# Altium schematic sheet SolarPanel3.SchDoc
size C
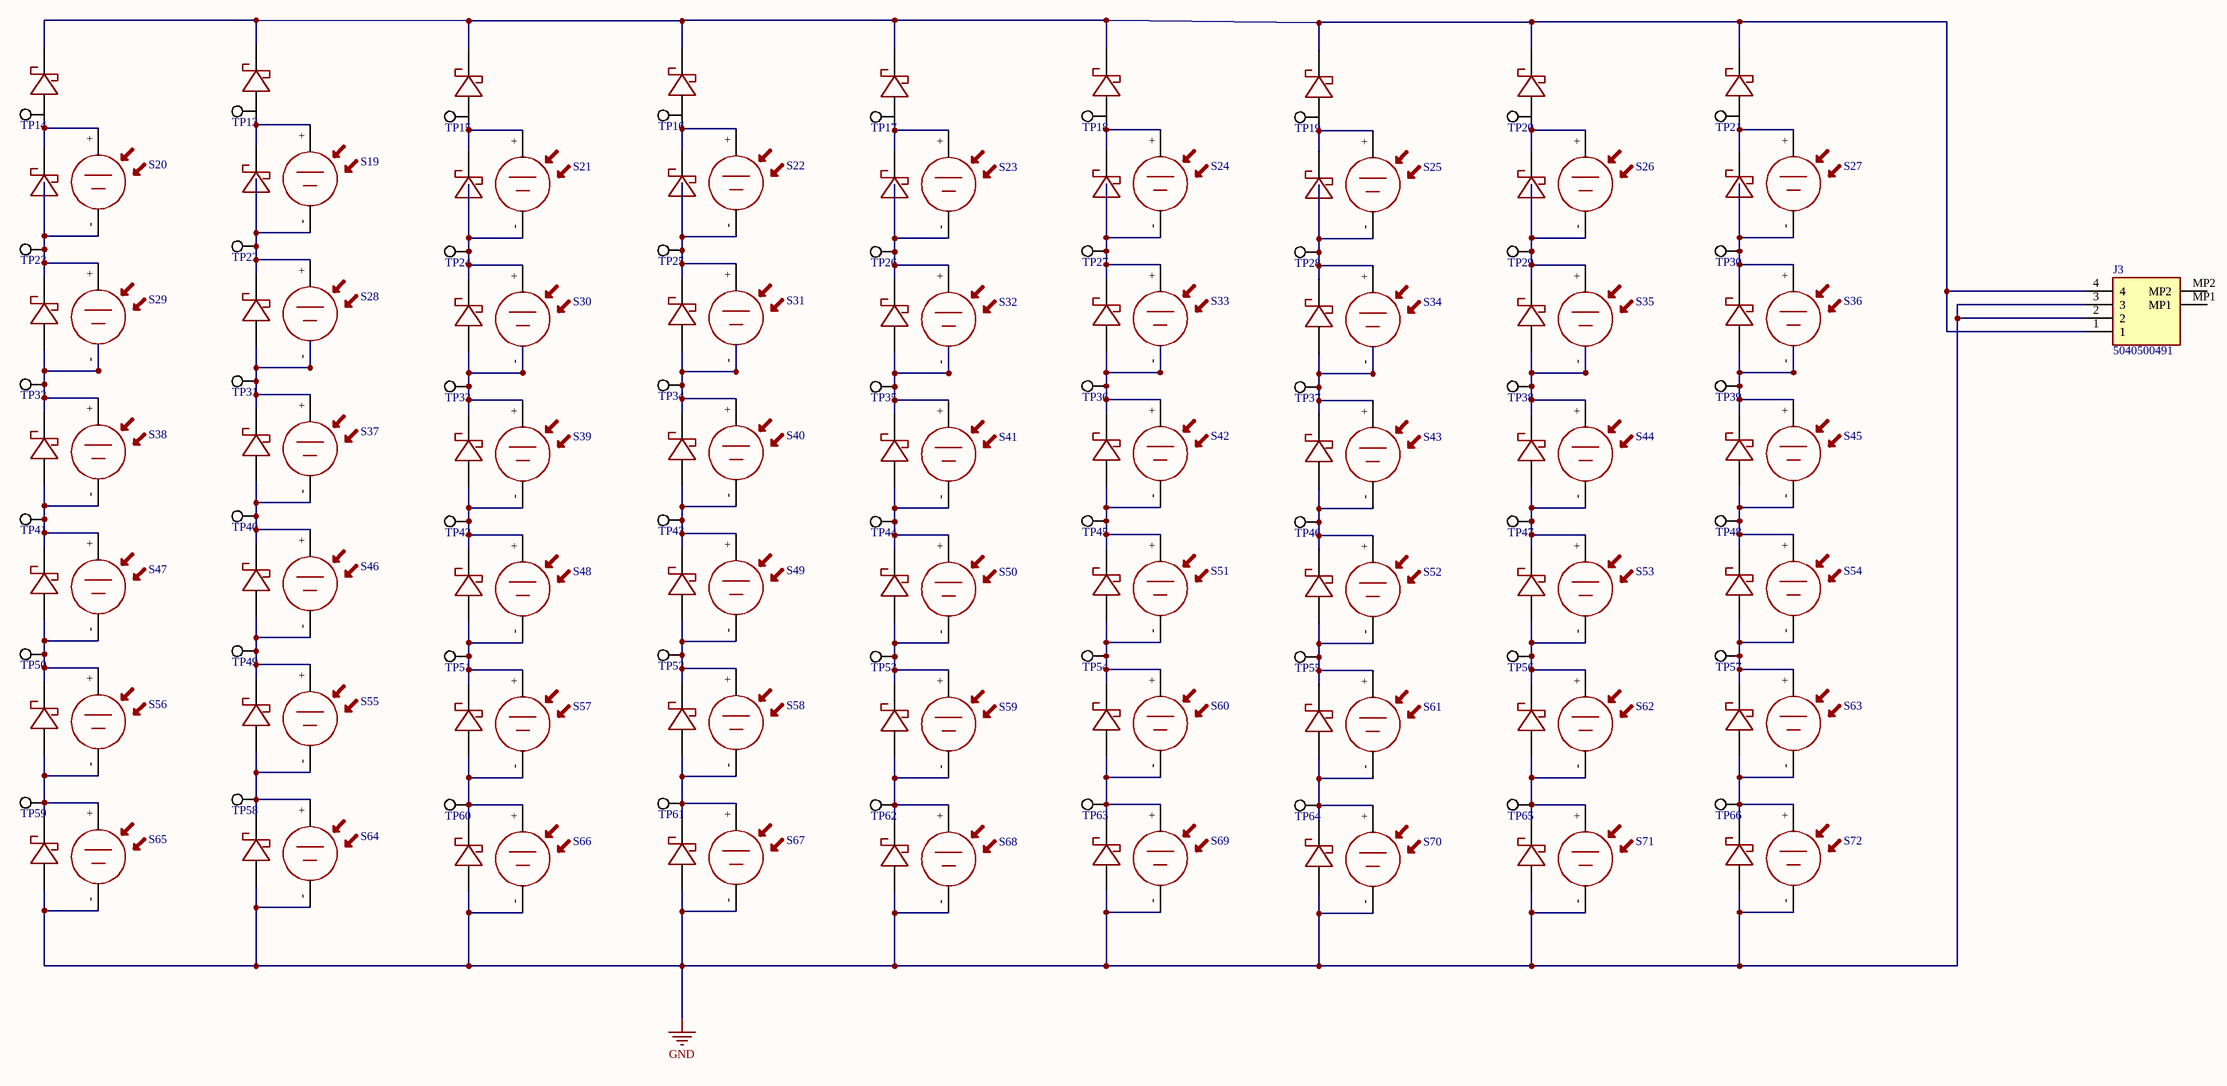
[diagram p0: SolarPanel3.SchDoc]

## Parts
D15  SCHOTTKY_DIODE_B120-FDICT-NDSCHOTTKY_DIODE_B120-FDICT-ND  [SB_DIODE]  (value not drawn)
D16  SCHOTTKY_DIODE_B120-FDICT-NDSCHOTTKY_DIODE_B120-FDICT-ND  [SB_DIODE]  (value not drawn)
D17  SCHOTTKY_DIODE_B120-FDICT-NDSCHOTTKY_DIODE_B120-FDICT-ND  [SB_DIODE]  (value not drawn)
D18  SCHOTTKY_DIODE_B120-FDICT-NDSCHOTTKY_DIODE_B120-FDICT-ND  [SB_DIODE]  (value not drawn)
D19  SCHOTTKY_DIODE_B120-FDICT-NDSCHOTTKY_DIODE_B120-FDICT-ND  [SB_DIODE]  (value not drawn)
D20  SCHOTTKY_DIODE_B120-FDICT-NDSCHOTTKY_DIODE_B120-FDICT-ND  [SB_DIODE]  (value not drawn)
D21  SCHOTTKY_DIODE_B120-FDICT-NDSCHOTTKY_DIODE_B120-FDICT-ND  [SB_DIODE]  (value not drawn)
D22  SCHOTTKY_DIODE_B120-FDICT-NDSCHOTTKY_DIODE_B120-FDICT-ND  [SB_DIODE]  (value not drawn)
D23  SCHOTTKY_DIODE_B120-FDICT-NDSCHOTTKY_DIODE_B120-FDICT-ND  [SB_DIODE]  (value not drawn)
D24  SCHOTTKY_DIODE_B120-FDICT-NDSCHOTTKY_DIODE_B120-FDICT-ND  [SB_DIODE]  (value not drawn)
D25  SCHOTTKY_DIODE_B120-FDICT-NDSCHOTTKY_DIODE_B120-FDICT-ND  [SB_DIODE]  (value not drawn)
D26  SCHOTTKY_DIODE_B120-FDICT-NDSCHOTTKY_DIODE_B120-FDICT-ND  [SB_DIODE]  (value not drawn)
D27  SCHOTTKY_DIODE_B120-FDICT-NDSCHOTTKY_DIODE_B120-FDICT-ND  [SB_DIODE]  (value not drawn)
D28  SCHOTTKY_DIODE_B120-FDICT-NDSCHOTTKY_DIODE_B120-FDICT-ND  [SB_DIODE]  (value not drawn)
D29  SCHOTTKY_DIODE_B120-FDICT-NDSCHOTTKY_DIODE_B120-FDICT-ND  [SB_DIODE]  (value not drawn)
D30  SCHOTTKY_DIODE_B120-FDICT-NDSCHOTTKY_DIODE_B120-FDICT-ND  [SB_DIODE]  (value not drawn)
D31  SCHOTTKY_DIODE_B120-FDICT-NDSCHOTTKY_DIODE_B120-FDICT-ND  [SB_DIODE]  (value not drawn)
D32  SCHOTTKY_DIODE_B120-FDICT-NDSCHOTTKY_DIODE_B120-FDICT-ND  [SB_DIODE]  (value not drawn)
D33  SCHOTTKY_DIODE_B120-FDICT-NDSCHOTTKY_DIODE_B120-FDICT-ND  [SB_DIODE]  (value not drawn)
D34  SCHOTTKY_DIODE_B120-FDICT-NDSCHOTTKY_DIODE_B120-FDICT-ND  [SB_DIODE]  (value not drawn)
D35  SCHOTTKY_DIODE_B120-FDICT-NDSCHOTTKY_DIODE_B120-FDICT-ND  [SB_DIODE]  (value not drawn)
D36  SCHOTTKY_DIODE_B120-FDICT-NDSCHOTTKY_DIODE_B120-FDICT-ND  [SB_DIODE]  (value not drawn)
D37  SCHOTTKY_DIODE_B120-FDICT-NDSCHOTTKY_DIODE_B120-FDICT-ND  [SB_DIODE]  (value not drawn)
D38  SCHOTTKY_DIODE_B120-FDICT-NDSCHOTTKY_DIODE_B120-FDICT-ND  [SB_DIODE]  (value not drawn)
D39  SCHOTTKY_DIODE_B120-FDICT-NDSCHOTTKY_DIODE_B120-FDICT-ND  [SB_DIODE]  (value not drawn)
D40  SCHOTTKY_DIODE_B120-FDICT-NDSCHOTTKY_DIODE_B120-FDICT-ND  [SB_DIODE]  (value not drawn)
D41  SCHOTTKY_DIODE_B120-FDICT-NDSCHOTTKY_DIODE_B120-FDICT-ND  [SB_DIODE]  (value not drawn)
D42  SCHOTTKY_DIODE_B120-FDICT-NDSCHOTTKY_DIODE_B120-FDICT-ND  [SB_DIODE]  (value not drawn)
D43  SCHOTTKY_DIODE_B120-FDICT-NDSCHOTTKY_DIODE_B120-FDICT-ND  [SB_DIODE]  (value not drawn)
D44  SCHOTTKY_DIODE_B120-FDICT-NDSCHOTTKY_DIODE_B120-FDICT-ND  [SB_DIODE]  (value not drawn)
D45  SCHOTTKY_DIODE_B120-FDICT-NDSCHOTTKY_DIODE_B120-FDICT-ND  [SB_DIODE]  (value not drawn)
D46  SCHOTTKY_DIODE_B120-FDICT-NDSCHOTTKY_DIODE_B120-FDICT-ND  [SB_DIODE]  (value not drawn)
D47  SCHOTTKY_DIODE_B120-FDICT-NDSCHOTTKY_DIODE_B120-FDICT-ND  [SB_DIODE]  (value not drawn)
D48  SCHOTTKY_DIODE_B120-FDICT-NDSCHOTTKY_DIODE_B120-FDICT-ND  [SB_DIODE]  (value not drawn)
D49  SCHOTTKY_DIODE_B120-FDICT-NDSCHOTTKY_DIODE_B120-FDICT-ND  [SB_DIODE]  (value not drawn)
D50  SCHOTTKY_DIODE_B120-FDICT-NDSCHOTTKY_DIODE_B120-FDICT-ND  [SB_DIODE]  (value not drawn)
D51  SCHOTTKY_DIODE_B120-FDICT-NDSCHOTTKY_DIODE_B120-FDICT-ND  [SB_DIODE]  (value not drawn)
D52  SCHOTTKY_DIODE_B120-FDICT-NDSCHOTTKY_DIODE_B120-FDICT-ND  [SB_DIODE]  (value not drawn)
D53  SCHOTTKY_DIODE_B120-FDICT-NDSCHOTTKY_DIODE_B120-FDICT-ND  [SB_DIODE]  (value not drawn)
D54  SCHOTTKY_DIODE_B120-FDICT-NDSCHOTTKY_DIODE_B120-FDICT-ND  [SB_DIODE]  (value not drawn)
D55  SCHOTTKY_DIODE_B120-FDICT-NDSCHOTTKY_DIODE_B120-FDICT-ND  [SB_DIODE]  (value not drawn)
D56  SCHOTTKY_DIODE_B120-FDICT-NDSCHOTTKY_DIODE_B120-FDICT-ND  [SB_DIODE]  (value not drawn)
D57  SCHOTTKY_DIODE_B120-FDICT-NDSCHOTTKY_DIODE_B120-FDICT-ND  [SB_DIODE]  (value not drawn)
D58  SCHOTTKY_DIODE_B120-FDICT-NDSCHOTTKY_DIODE_B120-FDICT-ND  [SB_DIODE]  (value not drawn)
D59  SCHOTTKY_DIODE_B120-FDICT-NDSCHOTTKY_DIODE_B120-FDICT-ND  [SB_DIODE]  (value not drawn)
D60  SCHOTTKY_DIODE_B120-FDICT-NDSCHOTTKY_DIODE_B120-FDICT-ND  [SB_DIODE]  (value not drawn)
D61  SCHOTTKY_DIODE_B120-FDICT-NDSCHOTTKY_DIODE_B120-FDICT-ND  [SB_DIODE]  (value not drawn)
D62  SCHOTTKY_DIODE_B120-FDICT-NDSCHOTTKY_DIODE_B120-FDICT-ND  [SB_DIODE]  (value not drawn)
D63  SCHOTTKY_DIODE_B120-FDICT-NDSCHOTTKY_DIODE_B120-FDICT-ND  [SB_DIODE]  (value not drawn)
D64  SCHOTTKY_DIODE_B120-FDICT-NDSCHOTTKY_DIODE_B120-FDICT-ND  [SB_DIODE]  (value not drawn)
D65  SCHOTTKY_DIODE_B120-FDICT-NDSCHOTTKY_DIODE_B120-FDICT-ND  [SB_DIODE]  (value not drawn)
D66  SCHOTTKY_DIODE_B120-FDICT-NDSCHOTTKY_DIODE_B120-FDICT-ND  [SB_DIODE]  (value not drawn)
D67  SCHOTTKY_DIODE_B120-FDICT-NDSCHOTTKY_DIODE_B120-FDICT-ND  [SB_DIODE]  (value not drawn)
D68  SCHOTTKY_DIODE_B120-FDICT-NDSCHOTTKY_DIODE_B120-FDICT-ND  [SB_DIODE]  (value not drawn)
D69  SCHOTTKY_DIODE_B120-FDICT-NDSCHOTTKY_DIODE_B120-FDICT-ND  [SB_DIODE]  (value not drawn)
D70  SCHOTTKY_DIODE_B120-FDICT-NDSCHOTTKY_DIODE_B120-FDICT-ND  [SB_DIODE]  (value not drawn)
D71  SCHOTTKY_DIODE_B120-FDICT-NDSCHOTTKY_DIODE_B120-FDICT-ND  [SB_DIODE]  (value not drawn)
D72  SCHOTTKY_DIODE_B120-FDICT-NDSCHOTTKY_DIODE_B120-FDICT-ND  [SB_DIODE]  (value not drawn)
D73  SCHOTTKY_DIODE_B120-FDICT-NDSCHOTTKY_DIODE_B120-FDICT-ND  [SB_DIODE]  (value not drawn)
D74  SCHOTTKY_DIODE_B120-FDICT-NDSCHOTTKY_DIODE_B120-FDICT-ND  [SB_DIODE]  (value not drawn)
D75  SCHOTTKY_DIODE_B120-FDICT-NDSCHOTTKY_DIODE_B120-FDICT-ND  [SB_DIODE]  (value not drawn)
D76  SCHOTTKY_DIODE_B120-FDICT-NDSCHOTTKY_DIODE_B120-FDICT-ND  [SB_DIODE]  (value not drawn)
D77  SCHOTTKY_DIODE_B120-FDICT-NDSCHOTTKY_DIODE_B120-FDICT-ND  [SB_DIODE]  (value not drawn)
J3  5040500491  [5040500491]
S19  SOLAR_CELL  [SOLAR_CELL]  (value not drawn)
S20  SOLAR_CELL  [SOLAR_CELL]  (value not drawn)
S21  SOLAR_CELL  [SOLAR_CELL]  (value not drawn)
S22  SOLAR_CELL  [SOLAR_CELL]  (value not drawn)
S23  SOLAR_CELL  [SOLAR_CELL]  (value not drawn)
S24  SOLAR_CELL  [SOLAR_CELL]  (value not drawn)
S25  SOLAR_CELL  [SOLAR_CELL]  (value not drawn)
S26  SOLAR_CELL  [SOLAR_CELL]  (value not drawn)
S27  SOLAR_CELL  [SOLAR_CELL]  (value not drawn)
S28  SOLAR_CELL  [SOLAR_CELL]  (value not drawn)
S29  SOLAR_CELL  [SOLAR_CELL]  (value not drawn)
S30  SOLAR_CELL  [SOLAR_CELL]  (value not drawn)
S31  SOLAR_CELL  [SOLAR_CELL]  (value not drawn)
S32  SOLAR_CELL  [SOLAR_CELL]  (value not drawn)
S33  SOLAR_CELL  [SOLAR_CELL]  (value not drawn)
S34  SOLAR_CELL  [SOLAR_CELL]  (value not drawn)
S35  SOLAR_CELL  [SOLAR_CELL]  (value not drawn)
S36  SOLAR_CELL  [SOLAR_CELL]  (value not drawn)
S37  SOLAR_CELL  [SOLAR_CELL]  (value not drawn)
S38  SOLAR_CELL  [SOLAR_CELL]  (value not drawn)
S39  SOLAR_CELL  [SOLAR_CELL]  (value not drawn)
S40  SOLAR_CELL  [SOLAR_CELL]  (value not drawn)
S41  SOLAR_CELL  [SOLAR_CELL]  (value not drawn)
S42  SOLAR_CELL  [SOLAR_CELL]  (value not drawn)
S43  SOLAR_CELL  [SOLAR_CELL]  (value not drawn)
S44  SOLAR_CELL  [SOLAR_CELL]  (value not drawn)
S45  SOLAR_CELL  [SOLAR_CELL]  (value not drawn)
S46  SOLAR_CELL  [SOLAR_CELL]  (value not drawn)
S47  SOLAR_CELL  [SOLAR_CELL]  (value not drawn)
S48  SOLAR_CELL  [SOLAR_CELL]  (value not drawn)
S49  SOLAR_CELL  [SOLAR_CELL]  (value not drawn)
S50  SOLAR_CELL  [SOLAR_CELL]  (value not drawn)
S51  SOLAR_CELL  [SOLAR_CELL]  (value not drawn)
S52  SOLAR_CELL  [SOLAR_CELL]  (value not drawn)
S53  SOLAR_CELL  [SOLAR_CELL]  (value not drawn)
S54  SOLAR_CELL  [SOLAR_CELL]  (value not drawn)
S55  SOLAR_CELL  [SOLAR_CELL]  (value not drawn)
S56  SOLAR_CELL  [SOLAR_CELL]  (value not drawn)
S57  SOLAR_CELL  [SOLAR_CELL]  (value not drawn)
S58  SOLAR_CELL  [SOLAR_CELL]  (value not drawn)
S59  SOLAR_CELL  [SOLAR_CELL]  (value not drawn)
S60  SOLAR_CELL  [SOLAR_CELL]  (value not drawn)
S61  SOLAR_CELL  [SOLAR_CELL]  (value not drawn)
S62  SOLAR_CELL  [SOLAR_CELL]  (value not drawn)
S63  SOLAR_CELL  [SOLAR_CELL]  (value not drawn)
S64  SOLAR_CELL  [SOLAR_CELL]  (value not drawn)
S65  SOLAR_CELL  [SOLAR_CELL]  (value not drawn)
S66  SOLAR_CELL  [SOLAR_CELL]  (value not drawn)
S67  SOLAR_CELL  [SOLAR_CELL]  (value not drawn)
S68  SOLAR_CELL  [SOLAR_CELL]  (value not drawn)
S69  SOLAR_CELL  [SOLAR_CELL]  (value not drawn)
S70  SOLAR_CELL  [SOLAR_CELL]  (value not drawn)
S71  SOLAR_CELL  [SOLAR_CELL]  (value not drawn)
S72  SOLAR_CELL  [SOLAR_CELL]  (value not drawn)
TP13  TEST_POINT  [TEST_POINT]  (value not drawn)
TP14  TEST_POINT  [TEST_POINT]  (value not drawn)
TP15  TEST_POINT  [TEST_POINT]  (value not drawn)
TP16  TEST_POINT  [TEST_POINT]  (value not drawn)
TP17  TEST_POINT  [TEST_POINT]  (value not drawn)
TP18  TEST_POINT  [TEST_POINT]  (value not drawn)
TP19  TEST_POINT  [TEST_POINT]  (value not drawn)
TP20  TEST_POINT  [TEST_POINT]  (value not drawn)
TP21  TEST_POINT  [TEST_POINT]  (value not drawn)
TP22  TEST_POINT  [TEST_POINT]  (value not drawn)
TP23  TEST_POINT  [TEST_POINT]  (value not drawn)
TP24  TEST_POINT  [TEST_POINT]  (value not drawn)
TP25  TEST_POINT  [TEST_POINT]  (value not drawn)
TP26  TEST_POINT  [TEST_POINT]  (value not drawn)
TP27  TEST_POINT  [TEST_POINT]  (value not drawn)
TP28  TEST_POINT  [TEST_POINT]  (value not drawn)
TP29  TEST_POINT  [TEST_POINT]  (value not drawn)
TP30  TEST_POINT  [TEST_POINT]  (value not drawn)
TP31  TEST_POINT  [TEST_POINT]  (value not drawn)
TP32  TEST_POINT  [TEST_POINT]  (value not drawn)
TP33  TEST_POINT  [TEST_POINT]  (value not drawn)
TP34  TEST_POINT  [TEST_POINT]  (value not drawn)
TP35  TEST_POINT  [TEST_POINT]  (value not drawn)
TP36  TEST_POINT  [TEST_POINT]  (value not drawn)
TP37  TEST_POINT  [TEST_POINT]  (value not drawn)
TP38  TEST_POINT  [TEST_POINT]  (value not drawn)
TP39  TEST_POINT  [TEST_POINT]  (value not drawn)
TP40  TEST_POINT  [TEST_POINT]  (value not drawn)
TP41  TEST_POINT  [TEST_POINT]  (value not drawn)
TP42  TEST_POINT  [TEST_POINT]  (value not drawn)
TP43  TEST_POINT  [TEST_POINT]  (value not drawn)
TP44  TEST_POINT  [TEST_POINT]  (value not drawn)
TP45  TEST_POINT  [TEST_POINT]  (value not drawn)
TP46  TEST_POINT  [TEST_POINT]  (value not drawn)
TP47  TEST_POINT  [TEST_POINT]  (value not drawn)
TP48  TEST_POINT  [TEST_POINT]  (value not drawn)
TP49  TEST_POINT  [TEST_POINT]  (value not drawn)
TP50  TEST_POINT  [TEST_POINT]  (value not drawn)
TP51  TEST_POINT  [TEST_POINT]  (value not drawn)
TP52  TEST_POINT  [TEST_POINT]  (value not drawn)
TP53  TEST_POINT  [TEST_POINT]  (value not drawn)
TP54  TEST_POINT  [TEST_POINT]  (value not drawn)
TP55  TEST_POINT  [TEST_POINT]  (value not drawn)
TP56  TEST_POINT  [TEST_POINT]  (value not drawn)
TP57  TEST_POINT  [TEST_POINT]  (value not drawn)
TP58  TEST_POINT  [TEST_POINT]  (value not drawn)
TP59  TEST_POINT  [TEST_POINT]  (value not drawn)
TP60  TEST_POINT  [TEST_POINT]  (value not drawn)
TP61  TEST_POINT  [TEST_POINT]  (value not drawn)
TP62  TEST_POINT  [TEST_POINT]  (value not drawn)
TP63  TEST_POINT  [TEST_POINT]  (value not drawn)
TP64  TEST_POINT  [TEST_POINT]  (value not drawn)
TP65  TEST_POINT  [TEST_POINT]  (value not drawn)
TP66  TEST_POINT  [TEST_POINT]  (value not drawn)

## Nets
GND: D69.POS D70.POS D71.POS D72.POS D73.POS D74.POS D75.POS D76.POS D77.POS J3.2 J3.3 S64.- S65.- S66.- S67.- S68.- S69.- S70.- S71.- S72.-
NetD15_NEG: D15.NEG D16.NEG D17.NEG D18.NEG D19.NEG D20.NEG D21.NEG D22.NEG D23.NEG J3.1 J3.4
NetD15_POS: D15.POS D24.NEG S19.+
NetD16_POS: D16.POS D25.NEG S20.+
NetD17_POS: D17.POS D26.NEG S21.+
NetD18_POS: D18.POS D27.NEG S22.+
NetD19_POS: D19.POS D28.NEG S23.+
NetD20_POS: D20.POS D29.NEG S24.+
NetD21_POS: D21.POS D30.NEG S25.+
NetD22_POS: D22.POS D31.NEG S26.+
NetD23_POS: D23.POS D32.NEG S27.+
NetD33_NEG: D33.NEG S19.- S28.+ TP22.38
NetD33_POS: D33.POS D42.NEG S28.- S37.+ TP31.38
NetD34_NEG: D34.NEG S20.- S29.+ TP23.38
NetD34_POS: D34.POS D43.NEG S29.- S38.+ TP32.38
NetD35_NEG: D35.NEG S21.- S30.+ TP24.38
NetD35_POS: D35.POS D44.NEG S30.- S39.+ TP33.38
NetD36_NEG: D36.NEG S22.- S31.+ TP25.38
NetD36_POS: D36.POS D45.NEG S31.- S40.+ TP34.38
NetD37_NEG: D37.NEG S23.- S32.+ TP26.38
NetD37_POS: D37.POS D46.NEG S32.- S41.+ TP35.38
NetD38_NEG: D38.NEG S24.- S33.+ TP27.38
NetD38_POS: D38.POS D47.NEG S33.- S42.+ TP36.38
NetD39_NEG: D39.NEG S25.- S34.+ TP28.38
NetD39_POS: D39.POS D48.NEG S34.- S43.+ TP37.38
NetD40_NEG: D40.NEG S26.- S35.+ TP29.38
NetD40_POS: D40.POS D49.NEG S35.- S44.+ TP38.38
NetD41_NEG: D41.NEG S27.- S36.+ TP30.38
NetD41_POS: D41.POS D50.NEG S36.- S45.+ TP39.38
NetD42_POS: D42.POS D51.NEG S37.- S46.+ TP40.38
NetD43_POS: D43.POS D52.NEG S38.- S47.+ TP41.38
NetD44_POS: D44.POS D53.NEG S39.- S48.+ TP42.38
NetD45_POS: D45.POS D54.NEG S40.- S49.+ TP43.38
NetD46_POS: D46.POS D55.NEG S41.- S50.+ TP44.38
NetD47_POS: D47.POS D56.NEG S42.- S51.+ TP45.38
NetD48_POS: D48.POS D57.NEG S43.- S52.+ TP46.38
NetD49_POS: D49.POS D58.NEG S44.- S53.+ TP47.38
NetD50_POS: D50.POS D59.NEG S45.- S54.+ TP48.38
NetD51_POS: D51.POS D60.NEG S46.- S55.+ TP49.38
NetD52_POS: D52.POS D61.NEG S47.- S56.+ TP50.38
NetD53_POS: D53.POS D62.NEG S48.- S57.+ TP51.38
NetD54_POS: D54.POS D63.NEG S49.- S58.+ TP52.38
NetD55_POS: D55.POS D64.NEG S50.- S59.+ TP53.38
NetD56_POS: D56.POS D65.NEG S51.- S60.+ TP54.38
NetD57_POS: D57.POS D66.NEG S52.- S61.+ TP55.38
NetD58_POS: D58.POS D67.NEG S53.- S62.+ TP56.38
NetD59_POS: D59.POS D68.NEG S54.- S63.+ TP57.38
NetD60_POS: D60.POS D69.NEG S55.- S64.+ TP58.38
NetD61_POS: D61.POS D70.NEG S56.- S65.+ TP59.38
NetD62_POS: D62.POS D71.NEG S57.- S66.+ TP60.38
NetD63_POS: D63.POS D72.NEG S58.- S67.+ TP61.38
NetD64_POS: D64.POS D73.NEG S59.- S68.+ TP62.38
NetD65_POS: D65.POS D74.NEG S60.- S69.+ TP63.38
NetD66_POS: D66.POS D75.NEG S61.- S70.+ TP64.38
NetD67_POS: D67.POS D76.NEG S62.- S71.+ TP65.38
NetD68_POS: D68.POS D77.NEG S63.- S72.+ TP66.38

Not connected (* = marked no-connect by the designer): J3 MP1 MP2; TP13 38; TP14 38; TP15 38; TP16 38; TP17 38; TP18 38; TP19 38; TP20 38; TP21 38

## Library data of the parts
D15-D77 = SCHOTTKY_DIODE_B120-FDICT-NDSCHOTTKY_DIODE_B120-FDICT-ND: GateName_1: G$1; SymbolName_1: SCHOTTKY_DIODE_B120-FDICT-ND; DeviceName: SCHOTTKY_DIODE_B120-FDICT-ND; LibraryName: Solar_Fadi; DeviceSetName: SCHOTTKY_DIODE_B120-FDICT-ND; Package: SCHOTTKY_DIODE_B120-FDICT-ND
J3 = 5040500491: Connector; Manufacturer_Name: Molex; Allied_Number: 70331790; Datasheet Link: https://www.molex.com/pdm_docs/sd/5040500691_sd.pdf; Height: 2.15mm; Manufacturer_Part_Number: 5040500491; Allied Price/Stock: https://www.alliedelec.com/molex-incorporated-5040500491/70331790/
TP13-TP66 = TEST_POINT: pin to pad: 38>PAD